# EAGLE design footprints proof (EAGLE 7.0.0)
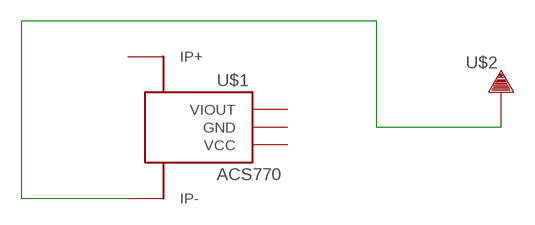
[diagram p0: schematic, sheet 1]

## Parts
U$1  ACS770  [PFF_LEADFORM]
U$2  TERMINAL_HOLE  [LARGE_TERMINAL_HOLE]

## Nets
N$1: U$1.5_1(IP-) U$1.5_2(IP-) U$1.5_3(IP-) U$1.5_4(IP-) U$1.5_5(IP-) U$1.5_6(IP-) U$1.5_7(IP-) U$1.5_8(IP-) U$1.5_9(IP-) U$1.5_10(IP-) U$1.5_11(IP-) U$1.5_12(IP-) U$1.5_13(IP-) U$1.5_14(IP-) U$1.5_15(IP-) U$1.5_16(IP-) U$1.5_B(IP-) U$1.5_T(IP-) U$2.P$1
Unconnected: U$1.1(VCC) U$1.2(GND) U$1.3(VIOUT) U$1.4_1(IP+) U$1.4_2(IP+) U$1.4_3(IP+) U$1.4_4(IP+) U$1.4_5(IP+) U$1.4_6(IP+) U$1.4_7(IP+) U$1.4_8(IP+) U$1.4_9(IP+) U$1.4_10(IP+) U$1.4_11(IP+) U$1.4_12(IP+) U$1.4_13(IP+) U$1.4_14(IP+) U$1.4_15(IP+) U$1.4_16(IP+) U$1.4_B(IP+) U$1.4_T(IP+)

## Library data of the parts
U$1 = MRDT-2015-BMS:ACS770
U$2 = MRDT-2015-PowerBoard:TERMINAL_HOLE

## Board
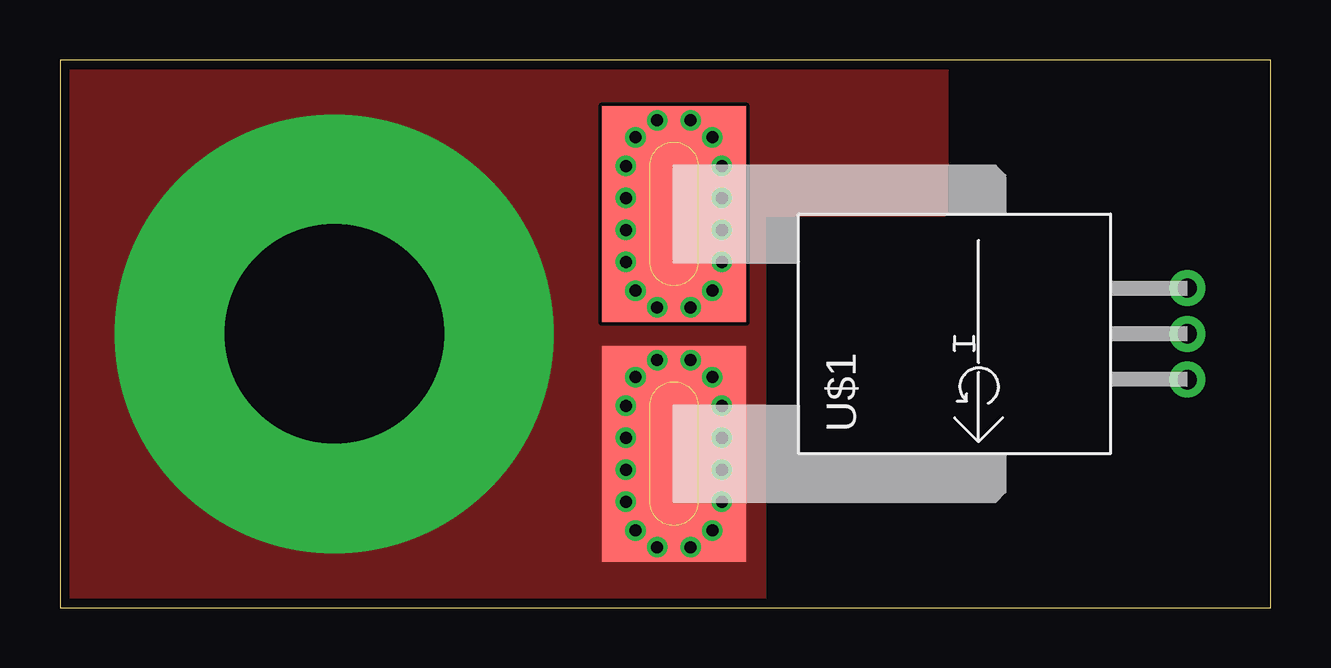
[diagram p1: board, top side]
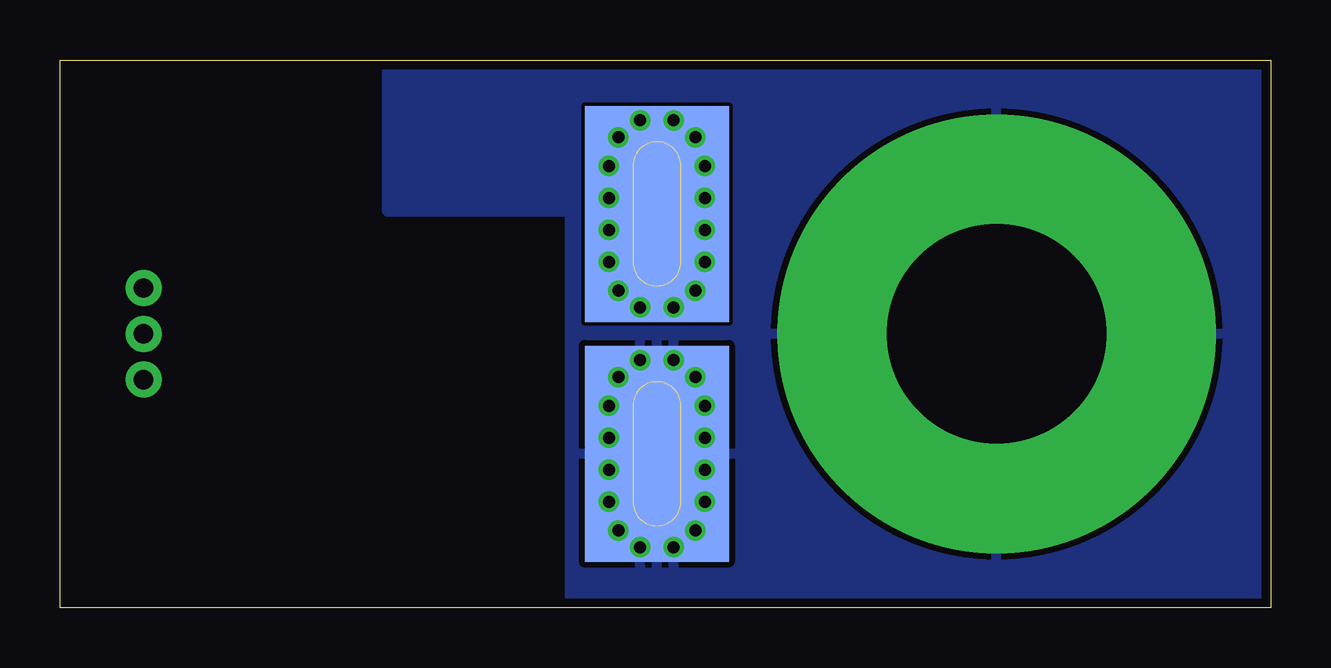
[diagram p2: board, bottom side, seen from below]

Size 50.47 x 22.85 mm. Coordinates in mm from the lower left corner, seen from the top.
Outline: 0,0 50.47,0 50.47,22.85 0,22.85 0,0
Copper layers (1*16): Top 0.0356mm / dielectric 1.5011mm / Bottom 0.0356mm
Design rules "OSHPark": minimum track width 6mil, minimum drill 13mil, track to track 6mil, track to pad 6mil, pad to pad 6mil, via to via 6mil, smd to smd 6mil, copper to edge 15mil, drill to drill 6mil, minimum pad ring 7mil, minimum via ring 7mil, stop-mask expansion 3mil, vias tented up to drill 0mil, thermal gap 10mil

### Footprints (pad centres in the part's own frame; a part is rotated, then mirrored left to right if it is on the bottom)
PFF_LEADFORM = drill 0.8 pad 1.5: 1 -1.91,0; 2 0,0; 3 1.91,0 | drill 0.5: 4_1 3,23.4; 4_2 4.33,23.4; 4_3 5.67,23.4; 4_4 7,23.4; 4_5 8.2,23; 4_6 8.9,22.1; 4_7 8.9,20.7; 4_8 8.2,19.8; 4_9 7,19.4; 4_10 5.67,19.4; 4_11 4.33,19.4; 4_12 3,19.4; 4_13 1.8,19.8; 4_14 1.1,20.7; 4_15 1.1,22.1; 4_16 1.8,23; 5_1 -7,23.4; 5_2 -5.67,23.4; 5_3 -4.33,23.4; 5_4 -3,23.4; 5_5 -1.8,23; 5_6 -1.1,22.1; 5_7 -1.1,20.7; 5_8 -1.8,19.8; 5_9 -3,19.4; 5_10 -4.33,19.4; 5_11 -5.67,19.4; 5_12 -7,19.4; 5_13 -8.2,19.8; 5_14 -8.9,20.7; 5_15 -8.9,22.1; 5_16 -8.2,23 | smd 9 x 6 bottom: 4_B 5,21.4; 5_B -5,21.4 | smd 9 x 6: 4_T 5,21.4; 5_T -5,21.4
LARGE_TERMINAL_HOLE = drill 9.144 pad 18.288: P$1 0,0

### Placement (x,y rotation side)
U$1  46.99,11.43 90 top
U$2  11.43,11.43 0 top

### Tracks (layer width: path | path; a pad name or v marks a point on that pad's centre or on a via)
N$1
  pour Bottom: 0,26.67 0,0 29.21,0 29.21,16.51 36.83,16.51 36.83,19.05 36.83,29.21 0,29.21
  pour Top (no thermals): 0,0 0,29.21 36.83,29.21 36.83,16.51 29.21,16.51 29.21,0